# EAGLE design rpi1rev2 (EAGLE 6.5.0)
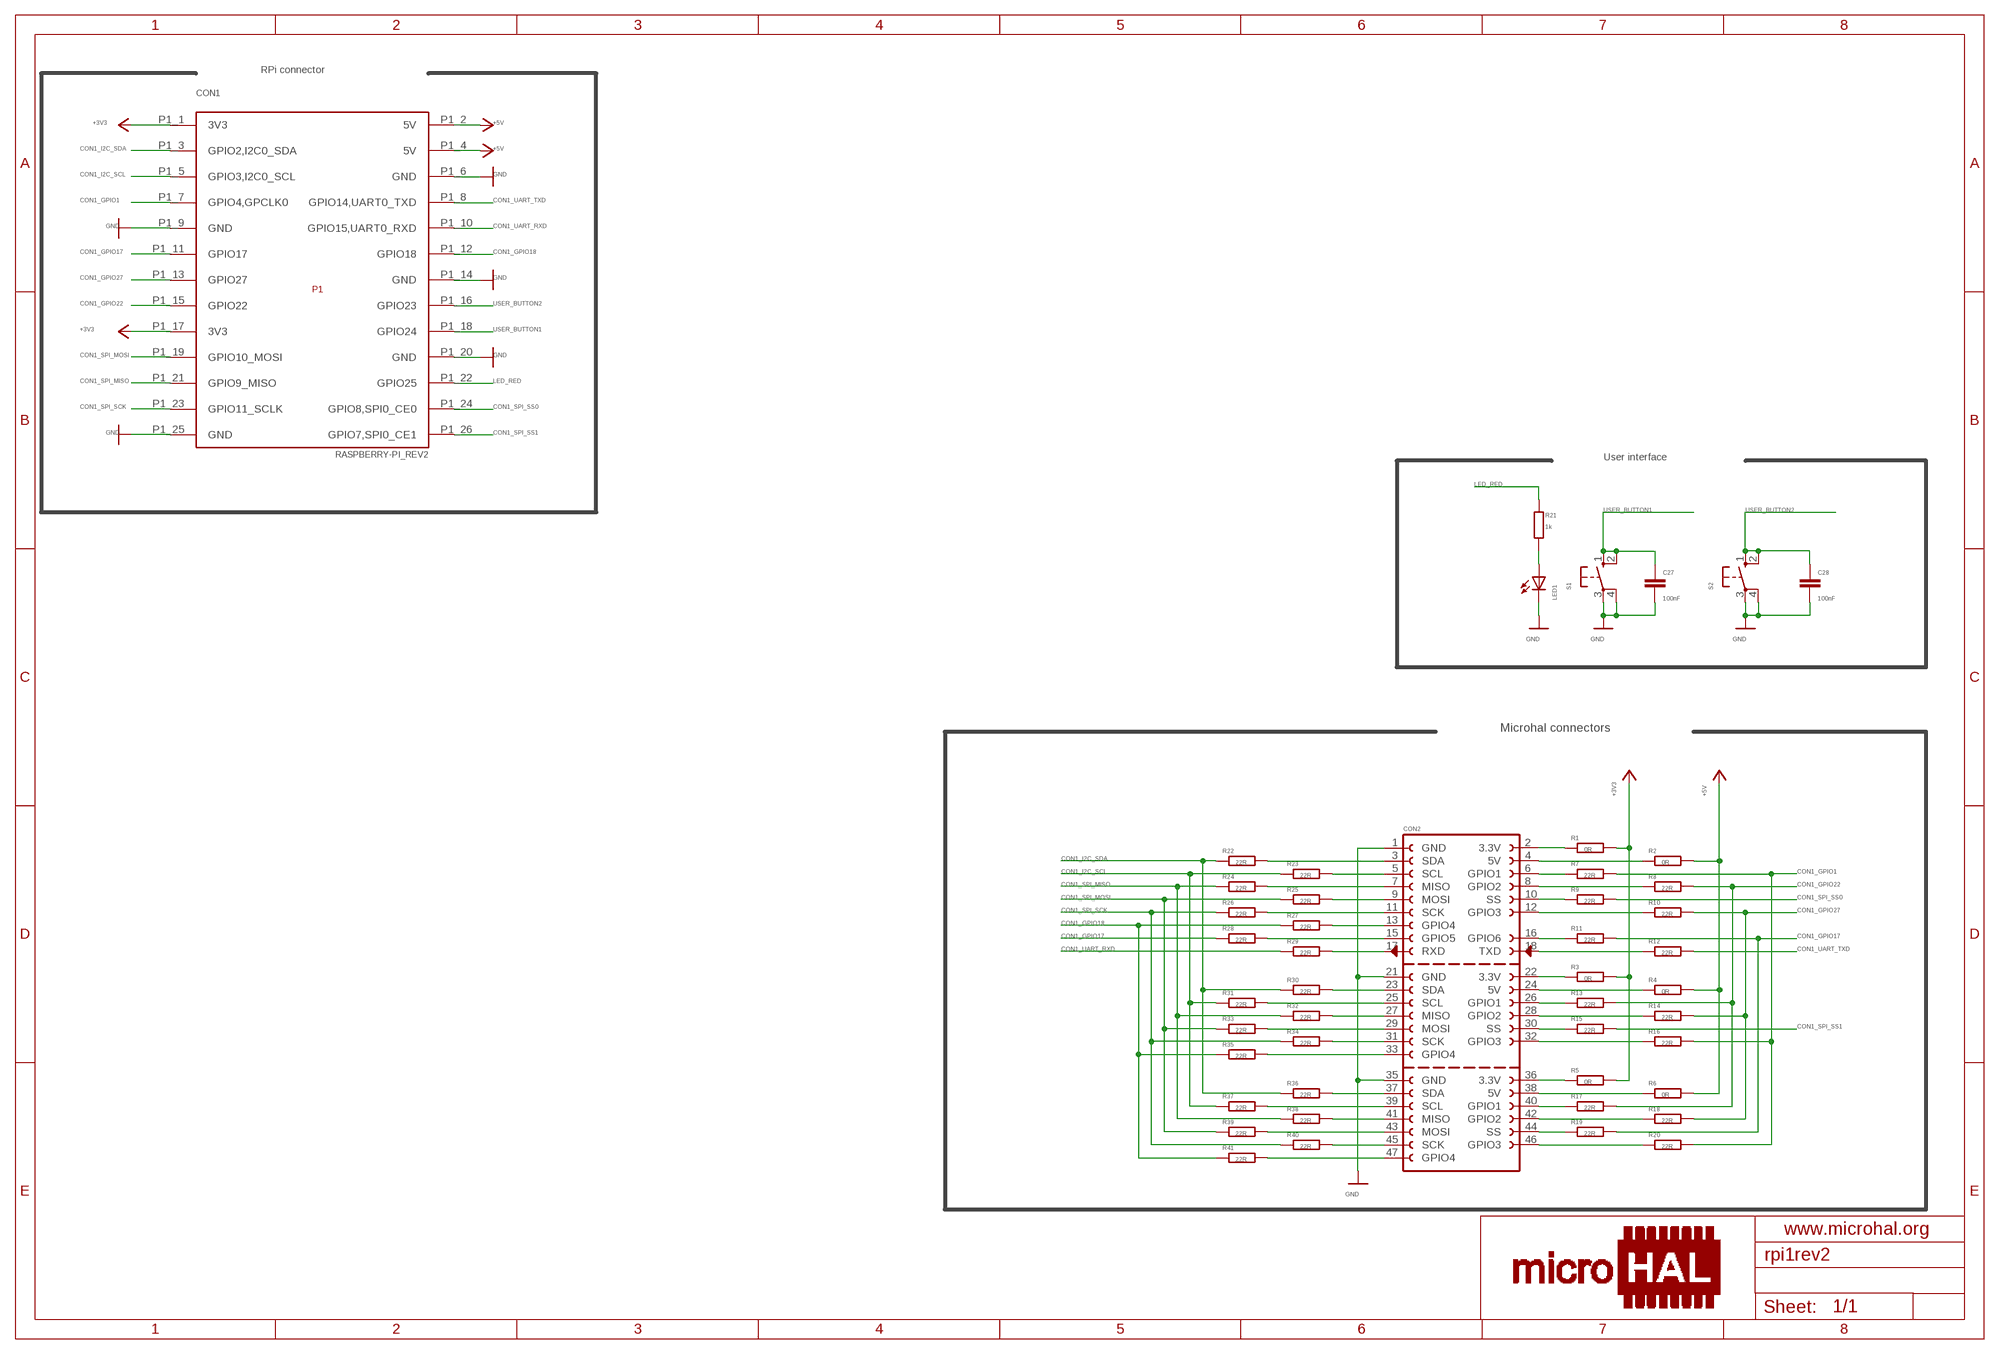
[diagram p0: schematic, sheet 1]

## Parts
C27  100nF  C-EUC0603K  [C0603K]
C28  100nF  C-EUC0603K  [C0603K]
CON1  RASPBERRY-PI_REV2  [RASPBERRY-PI_REV2]
CON2  MICROHAL_CONNECTOR_F_3  [MICROHAL_CONNECTOR_F_3]
LED1  LEDCHIPLED_0603  [CHIPLED_0603]
R1  0R  R-EU_R0603  [R0603]
R2  0R  R-EU_R0603  [R0603]
R3  0R  R-EU_R0603  [R0603]
R4  0R  R-EU_R0603  [R0603]
R5  0R  R-EU_R0603  [R0603]
R6  0R  R-EU_R0603  [R0603]
R7  22R  R-EU_R0603  [R0603]
R8  22R  R-EU_R0603  [R0603]
R9  22R  R-EU_R0603  [R0603]
R10  22R  R-EU_R0603  [R0603]
R11  22R  R-EU_R0603  [R0603]
R12  22R  R-EU_R0603  [R0603]
R13  22R  R-EU_R0603  [R0603]
R14  22R  R-EU_R0603  [R0603]
R15  22R  R-EU_R0603  [R0603]
R16  22R  R-EU_R0603  [R0603]
R17  22R  R-EU_R0603  [R0603]
R18  22R  R-EU_R0603  [R0603]
R19  22R  R-EU_R0603  [R0603]
R20  22R  R-EU_R0603  [R0603]
R21  1k  R-EU_R0603  [R0603]
R22  22R  R-EU_R0603  [R0603]
R23  22R  R-EU_R0603  [R0603]
R24  22R  R-EU_R0603  [R0603]
R25  22R  R-EU_R0603  [R0603]
R26  22R  R-EU_R0603  [R0603]
R27  22R  R-EU_R0603  [R0603]
R28  22R  R-EU_R0603  [R0603]
R29  22R  R-EU_R0603  [R0603]
R30  22R  R-EU_R0603  [R0603]
R31  22R  R-EU_R0603  [R0603]
R32  22R  R-EU_R0603  [R0603]
R33  22R  R-EU_R0603  [R0603]
R34  22R  R-EU_R0603  [R0603]
R35  22R  R-EU_R0603  [R0603]
R36  22R  R-EU_R0603  [R0603]
R37  22R  R-EU_R0603  [R0603]
R38  22R  R-EU_R0603  [R0603]
R39  22R  R-EU_R0603  [R0603]
R40  22R  R-EU_R0603  [R0603]
R41  22R  R-EU_R0603  [R0603]
S1  10-XX  [B3F-10XX]
S2  10-XX  [B3F-10XX]

## Nets
+3V3: CON1.P1_1(3V3) CON1.P1_17(3V3) R1.2 R3.2 R5.2
+5V: CON1.P1_2(5V) CON1.P1_4(5V) R2.2 R4.2 R6.2
CON1_GPIO1: CON1.P1_7(GPIO4,GPCLK0) R7.2 R16.2 R20.2
CON1_GPIO17: CON1.P1_11(GPIO17) R11.2 R19.2 R28.1
CON1_GPIO18: CON1.P1_12(GPIO18) R27.1 R35.1 R41.1
CON1_GPIO22: CON1.P1_15(GPIO22) R8.2 R13.2 R17.2
CON1_GPIO27: CON1.P1_13(GPIO27) R10.2 R14.2 R18.2
CON1_I2C_SCL: CON1.P1_5(GPIO3,I2C0_SCL) R23.1 R31.1 R37.1
CON1_I2C_SDA: CON1.P1_3(GPIO2,I2C0_SDA) R22.1 R30.1 R36.1
CON1_SPI_MISO: CON1.P1_21(GPIO9_MISO) R24.1 R32.1 R38.1
CON1_SPI_MOSI: CON1.P1_19(GPIO10_MOSI) R25.1 R33.1 R39.1
CON1_SPI_SCK: CON1.P1_23(GPIO11_SCLK) R26.1 R34.1 R40.1
CON1_SPI_SS0: CON1.P1_24(GPIO8,SPI0_CE0) R9.2
CON1_SPI_SS1: CON1.P1_26(GPIO7,SPI0_CE1) R15.2
CON1_UART_RXD: CON1.P1_10(GPIO15,UART0_RXD) R29.1
CON1_UART_TXD: CON1.P1_8(GPIO14,UART0_TXD) R12.2
GND: C27.2 C28.2 CON1.P1_6(GND) CON1.P1_9(GND) CON1.P1_14(GND) CON1.P1_20(GND) CON1.P1_25(GND) CON2.1(GND) CON2.21(GND) CON2.35(GND) LED1.C S1.3(P) S1.4(P1) S2.3(P) S2.4(P1)
LED_RED: CON1.P1_22(GPIO25) R21.2
N$1: CON2.7(MISO) R24.2
N$4: CON2.2(3.3V) R1.1
N$5: CON2.4(5V) R2.1
N$6: CON2.22(3.3V) R3.1
N$7: CON2.24(5V) R4.1
N$8: CON2.36(3.3V) R5.1
N$9: CON2.38(5V) R6.1
N$10: CON2.6(GPIO1) R7.1
N$12: CON2.8(GPIO2) R8.1
N$21: CON2.10(SS) R9.1
N$22: CON2.12(GPIO3) R10.1
N$23: CON2.16(GPIO6) R11.1
N$25: CON2.18(TXD) R12.1
N$26: CON2.26(GPIO1) R13.1
N$28: CON2.28(GPIO2) R14.1
N$29: CON2.30(SS) R15.1
N$30: CON2.32(GPIO3) R16.1
N$34: CON2.40(GPIO1) R17.1
N$35: CON2.44(SS) R19.1
N$36: CON2.42(GPIO2) R18.1
N$37: CON2.46(GPIO3) R20.1
N$51: CON2.47(GPIO4) R41.2
N$52: CON2.45(SCK) R40.2
N$53: CON2.43(MOSI) R39.2
N$54: CON2.41(MISO) R38.2
N$55: CON2.39(SCL) R37.2
N$56: CON2.37(SDA) R36.2
N$57: CON2.33(GPIO4) R35.2
N$58: CON2.31(SCK) R34.2
N$59: CON2.29(MOSI) R33.2
N$60: CON2.27(MISO) R32.2
N$61: CON2.25(SCL) R31.2
N$62: CON2.23(SDA) R30.2
N$63: CON2.17(RXD) R29.2
N$64: CON2.13(GPIO4) R27.2
N$65: CON2.9(MOSI) R25.2
N$66: CON2.5(SCL) R23.2
N$67: CON2.3(SDA) R22.2
N$68: CON2.11(SCK) R26.2
N$69: CON2.15(GPIO5) R28.2
N$103: LED1.A R21.1
USER_BUTTON1: C27.1 CON1.P1_18(GPIO24) S1.1(S) S1.2(S1)
USER_BUTTON2: C28.1 CON1.P1_16(GPIO23) S2.1(S) S2.2(S1)

## Notes on the sheet
- RPi connector
- User interface
- Microhal connectors

## Library data of the parts
C27 C28 = rcl:C-EU: CAPACITOR, European symbol
CON1 = RaspberryPi:RASPBERRY-PI_REV2: Raspberry Pi Board <http://www.raspberrypi.org/> Jacques Lagnel V1.0 (beta) 2012 Mateusz Bawaj V1.1 (beta) 2012 Board dimension: Forum 3D model <http://www.raspberrypi.org/forum/general-discussion/mechanical-profile-3d-models?value=3d%20model&type=1&include=1&search=1&ret=all> The GPIO Connector (P1): http://elinux.org/RPi_Low-level_peripherals The GPIO Connector (P5): http://www.raspberrypi-spy.co.uk/2012/09/raspberry-pi-p5-header/
CON2 = microhal-connector_v0.1:MICROHAL_CONNECTOR_F_3: Connector used in microhal development board.
LED1 = led:LED: LED OSRAM: - CHIPLED LG R971, LG N971, LY N971, LG Q971, LY Q971, LO R971, LY R971 LH N974, LH R974 LS Q976, LO Q976, LY Q976 LO Q996 - Hyper CHIPLED LW Q18S LB Q993, LB Q99A, LB R99A - SideLED LS A670, LO A670, LY A670, LG A670, LP A670 LB A673, LV A673, LT A673, LW A673 LH A674 LY A675 LS A676, LA A676, LO A676, LY A676, LW A676 LS A679, LY A679, LG A679 - Hyper Micro SIDELED® LS Y876, LA Y876, LO Y876, LY Y876 LT Y87S - SmartLED LW L88C, LW L88S LB L89C, LB L89S, LG L890 LS L89K, LO L89K, LY L89K LS L896, LA L896, LO L896, LY L896 - TOPLED LS T670, LO T670, LY T670, LG T670, LP T670 LSG T670, LSP T670, LSY T670, LOP T670, LYG T670 LG T671, LOG T671, LSG T671 LB T673, LV T673, LT T673, LW T673 LH T674 LS T676, LA T676, LO T676, LY T676, LB T676, LH T676, LSB T676, LW T676 LB T67C, LV T67C, LT T67C, LS T67K, LO T67K, LY T67K, LW E67C LS E67B, LA E67B, LO E67B, LY E67B, LB E67C, LV E67C, LT E67C LW T67C LS T679, LY T679, LG T679 LS T770, LO T770, LY T770, LG T770, LP T770 LB T773, LV T773, LT T773, LW T773 LH T774 LS E675, LA E675, LY E675, LS T675 LS T776, LA T776, LO T776, LY T776, LB T776 LHGB T686 LT T68C, LB T68C - Hyper Mini TOPLED® LB M676 - Mini TOPLED Santana® LG M470 LS M47K, LO M47K, LY M47K Source: http://www.osram.convergy.de LUXEON: - LUMILED® LXK2-PW12-R00, LXK2-PW12-S00, LXK2-PW14-U00, LXK2-PW14-V00 LXK2-PM12-R00, LXK2-PM12-S00, LXK2-PM14-U00 LXK2-PE12-Q00, LXK2-PE12-R00, LXK2-PE12-S00, LXK2-PE14-T00, LXK2-PE14-U00 LXK2-PB12-K00, LXK2-PB12-L00, LXK2-PB12-M00, LXK2-PB14-N00, LXK2-PB14-P00, LXK2-PB14-Q00 LXK2-PR12-L00, LXK2-PR12-M00, LXK2-PR14-Q00, LXK2-PR14-R00 LXK2-PD12-Q00, LXK2-PD12-R00, LXK2-PD12-S00 LXK2-PH12-R00, LXK2-PH12-S00 LXK2-PL12-P00, LXK2-PL12-Q00, LXK2-PL12-R00 Source: www.luxeon.com KINGBRIGHT: KA-3528ASYC Source: www.kingbright.com
R1-R41 = rcl:R-EU_: RESISTOR, European symbol
S1 S2 = switch-omron:10-XX: OMRON SWITCH; MPN: B3F-1000; OC_FARNELL: 176432; OC_NEWARK: 36M3542

## Board
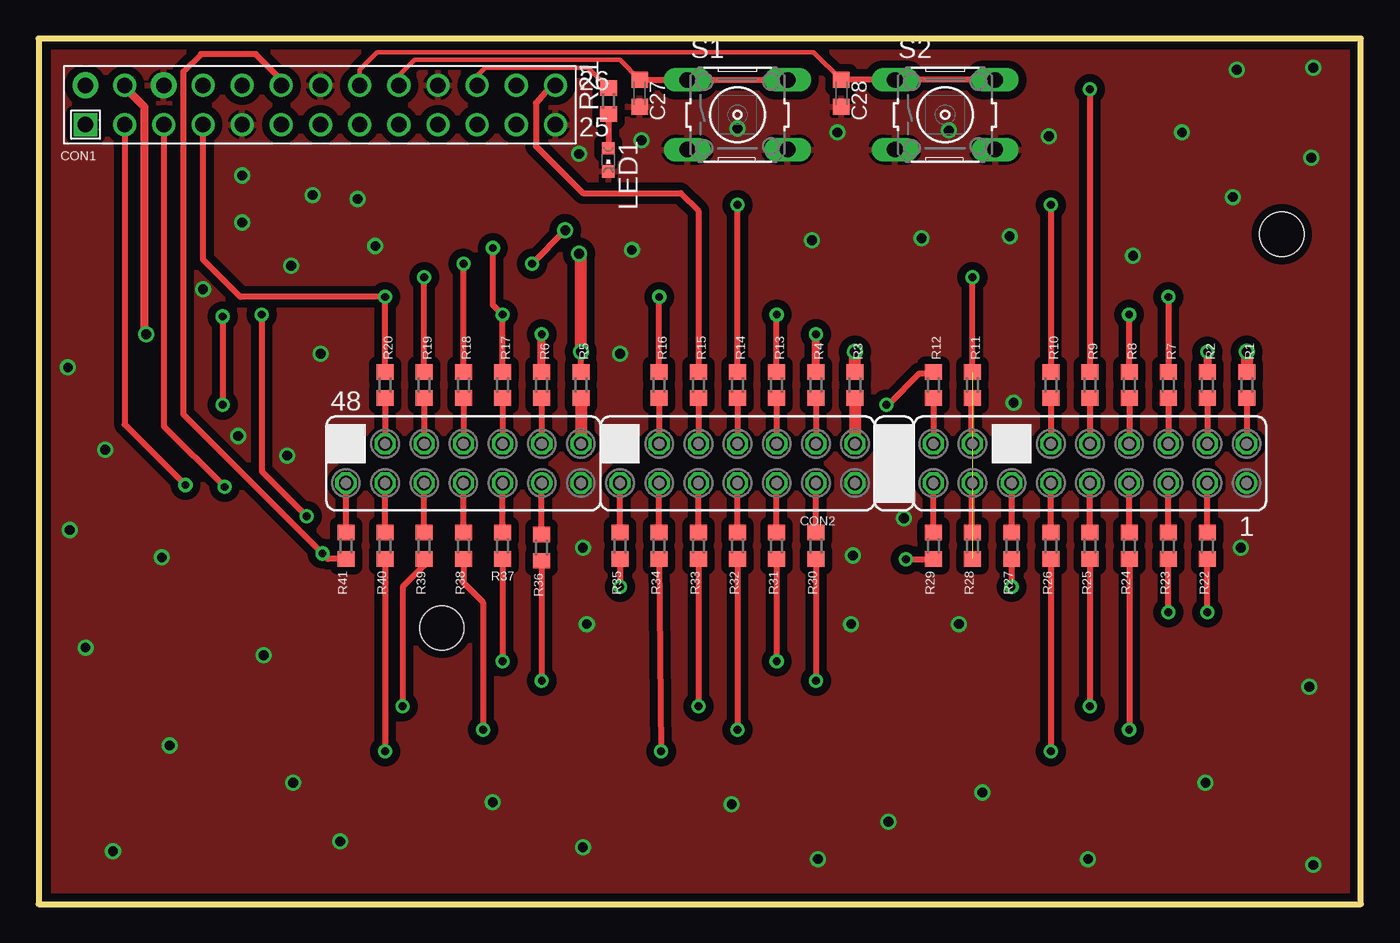
[diagram p1: board, top side]
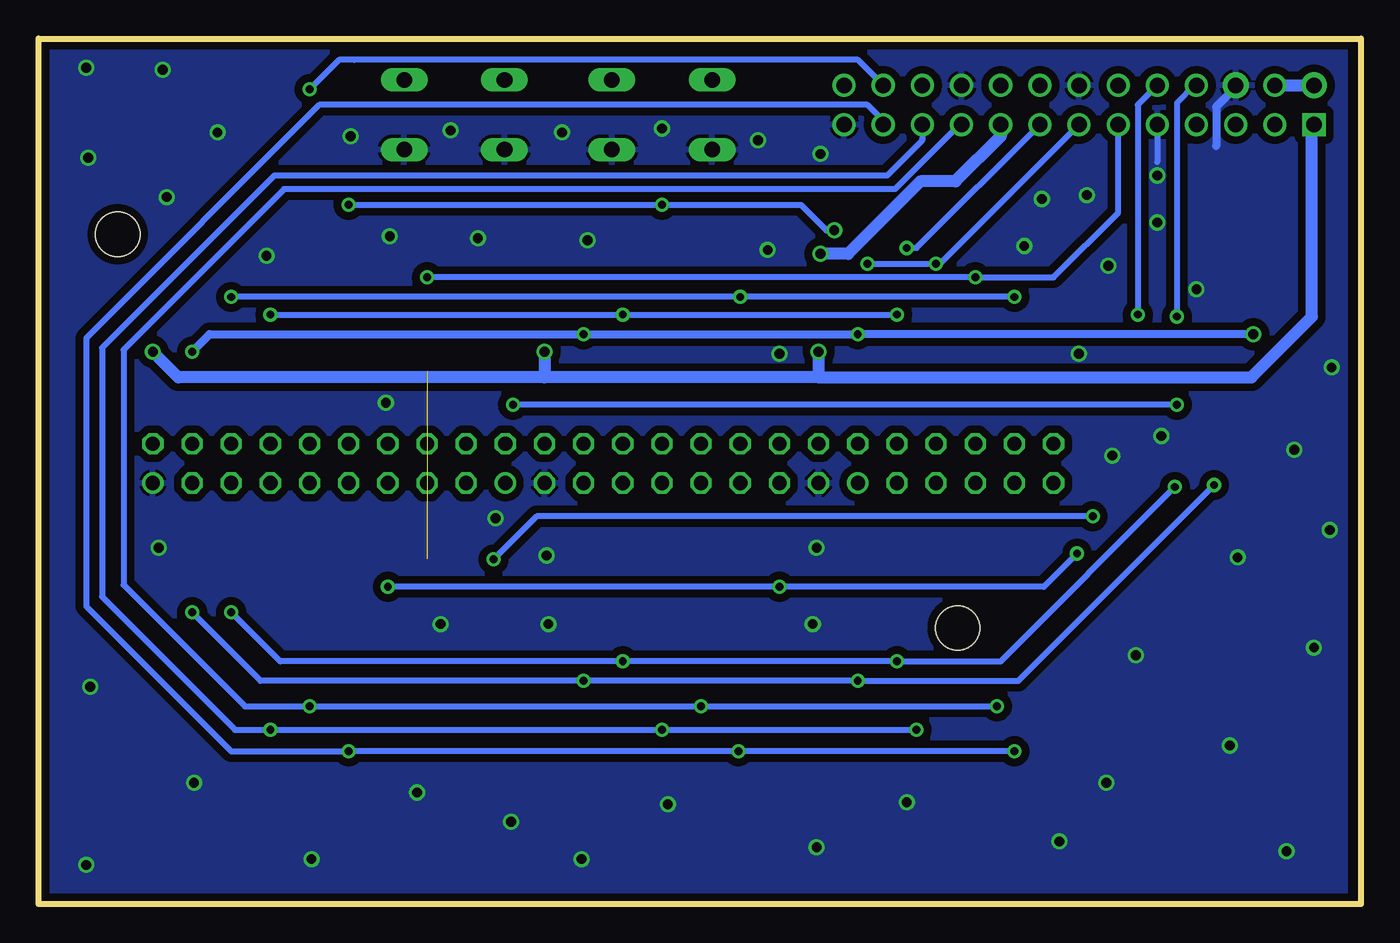
[diagram p2: board, bottom side, seen from below]

Size 85.78 x 56.12 mm. Coordinates in mm from the lower left corner, seen from the top.
Outline: 0,0 85.78,0 85.78,56.12 0,56.12 0,0
Copper layers (1*2+16): Top 0.035mm / dielectric 1.5mm / Route2 0.035mm / dielectric 0.15mm / Bottom 0.035mm
Design rules "satland_standard": minimum track width 8mil, minimum drill 0.3mm, track to track 8mil, track to pad 8mil, pad to pad 8mil, via to via 8mil, smd to smd 0mil, copper to edge 20mil, drill to drill 10mil, minimum pad ring 8mil, minimum via ring 8mil, stop-mask expansion 4mil, vias tented up to drill 0mil, thermal gap 8mil
Holes 2.87 mm at 26.16,17.91 80.64,43.43

### Footprints (pad centres in the part's own frame; a part is rotated, then mirrored left to right if it is on the bottom)
C0603K = smd 1.05 x 1.08: 1 -0.875,0; 2 0.875,0
RASPBERRY-PI_REV2 = drill 1 square: P1_1 -17.78,-1.27 | drill 1 pad 1.676: P1_2 -17.78,1.27; P1_6 -12.7,1.27 | drill 1: P1_3 -15.24,-1.27; P1_4 -15.24,1.27; P1_5 -12.7,-1.27; P1_7 -10.16,-1.27; P1_8 -10.16,1.27; P1_9 -7.62,-1.27; P1_10 -7.62,1.27; P1_11 -5.08,-1.27; P1_12 -5.08,1.27; P1_13 -2.54,-1.27; P1_14 -2.54,1.27; P1_15 0,-1.27; P1_16 0,1.27; P1_17 2.54,-1.27; P1_18 2.54,1.27; P1_19 5.08,-1.27; P1_20 5.08,1.27; P1_21 7.62,-1.27; P1_22 7.62,1.27; P1_23 10.16,-1.27; P1_24 10.16,1.27; P1_25 12.7,-1.27; P1_26 12.7,1.27
MICROHAL_CONNECTOR_F_3 = drill 0.914: 1 -33.02,1.27; 19 -10.16,1.27; 37 12.7,1.27 | drill 0.914 octagon: 2 -33.02,-1.27; 3 -30.48,1.27; 4 -30.48,-1.27; 5 -27.94,1.27; 6 -27.94,-1.27; 7 -25.4,1.27; 8 -25.4,-1.27; 9 -22.86,1.27; 10 -22.86,-1.27; 11 -20.32,1.27; 12 -20.32,-1.27; 13 -17.78,1.27; 14 -17.78,-1.27; 15 -15.24,1.27; 16 -15.24,-1.27; 17 -12.7,1.27; 18 -12.7,-1.27; 20 -10.16,-1.27; 21 -7.62,1.27; 22 -7.62,-1.27; 23 -5.08,1.27; 24 -5.08,-1.27; 25 -2.54,1.27; 26 -2.54,-1.27; 27 0,1.27; 28 0,-1.27; 29 2.54,1.27; 30 2.54,-1.27; 31 5.08,1.27; 32 5.08,-1.27; 33 7.62,1.27; 34 7.62,-1.27; 35 10.16,1.27; 36 10.16,-1.27; 38 12.7,-1.27; 39 15.24,1.27; 40 15.24,-1.27; 41 17.78,1.27; 42 17.78,-1.27; 43 20.32,1.27; 44 20.32,-1.27; 45 22.86,1.27; 46 22.86,-1.27; 47 25.4,1.27; 48 25.4,-1.27
CHIPLED_0603 = smd 0.8 x 0.8: A 0,-0.75; C 0,0.75
R0603 = smd 1 x 1.1: 1 -0.85,0; 2 0.85,0
B3F-10XX = drill 1.016 long: 1 -3.251,2.261; 2 3.251,2.261; 3 -3.251,-2.261; 4 3.251,-2.261

### Placement (x,y rotation side)
C27  38.99,52.58 270 top
C28  52.07,52.58 270 top
CON1  20.83,51.82 0 top
CON2  45.34,28.58 180 top
LED1  36.96,48.26 180 top
R1  78.36,33.66 90 top
R2  75.82,33.66 90 top
R3  52.96,33.66 90 top
R4  50.42,33.66 90 top
R5  35.18,33.66 90 top
R6  32.64,33.66 90 top
R7  73.28,33.66 90 top
R8  70.74,33.66 90 top
R9  68.2,33.66 90 top
R10  65.66,33.66 90 top
R11  60.58,33.66 90 top
R12  58.04,33.66 90 top
R13  47.88,33.66 90 top
R14  45.34,33.66 90 top
R15  42.8,33.66 90 top
R16  40.26,33.66 90 top
R17  30.1,33.66 90 top
R18  27.56,33.66 90 top
R19  25.02,33.66 90 top
R20  22.48,33.66 90 top
R21  36.96,52.07 90 top
R22  75.82,23.24 90 top
R23  73.28,23.24 90 top
R24  70.74,23.24 90 top
R25  68.2,23.24 90 top
R26  65.66,23.24 90 top
R27  63.12,23.24 90 top
R28  60.58,23.24 90 top
R29  58.04,23.24 90 top
R30  50.42,23.24 90 top
R31  47.88,23.24 90 top
R32  45.34,23.24 90 top
R33  42.8,23.24 90 top
R34  40.26,23.24 90 top
R35  37.72,23.24 90 top
R36  32.64,23.11 90 top
R37  30.1,23.24 90 top
R38  27.56,23.24 90 top
R39  25.02,23.24 90 top
R40  22.48,23.24 90 top
R41  19.94,23.24 90 top
S1  45.34,51.18 0 top
S2  58.8,51.18 0 top

### Tracks (layer width: path | path; a pad name or v marks a point on that pad's centre or on a via)
+3V3  (via drill 0.64)
  Top 0.381: R5.2 v35.18,35.81
  Top 0.762: v78.36,35.81 R1.2 | R3.2 v52.96,35.81 | v35.18,35.81 35.18,42.04 v35.05,42.16
  Bottom 0.762: 35.18,34.16 52.96,34.16 | v52.96,35.81 52.96,34.16 | v35.18,35.81 35.18,34.16 | 52.96,34.16 76.71,34.16 v78.36,35.81 | 35.18,34.16 7.11,34.16 3.18,38.1 3.18,50.42 CON1.P1_1 | CON1.P1_17 23.37,49.78 26.29,46.86 28.57,46.86 33.27,42.16 v35.05,42.16
+5V  (via drill 0.51, 0.64)
  Top 0.381: CON1.P1_4 5.59,52.96
  Top 0.457: 6.86,37.08 v6.99,36.96
  Top 0.508: 5.59,52.96 6.86,51.69 6.86,37.08 | v75.82,35.81 R2.2 | R4.2 v50.42,36.96 | R6.2 v32.64,36.96
  Bottom 0.508: v75.82,35.81 74.68,36.96 v50.42,36.96 v32.64,36.96 v6.99,36.96
  Bottom 0.762: CON1.P1_4 CON1.P1_2
CON1_GPIO1  (via drill 0.51)
  Top 0.381: v73.28,39.37 R7.2 | R16.2 v40.26,39.37 | R20.2 v22.48,39.37 13.08,39.37 10.67,41.78 CON1.P1_7
  Bottom 0.381: v22.48,39.37 v40.26,39.37 v73.28,39.37
CON1_GPIO17  (via drill 0.51)  (1 unrouted)
  Top 0.381: R11.2 v60.58,40.64 | R19.2 v25.02,40.64
  Bottom 0.381: v60.58,40.64 v25.02,40.64 19.94,40.64 15.75,44.83 CON1.P1_11
CON1_GPIO18  (via drill 0.51)
  Top 0.381: v63.12,20.57 R27.1 | R35.1 v37.72,20.57 | R41.1 18.76,22.39 v18.41,22.73 9.4,31.75 9.4,53.97 10.54,55.12 14.1,55.12 15.75,53.47 CON1.P1_12
  Bottom 0.381: v63.12,20.57 v37.72,20.57 20.57,20.57 v18.41,22.73
CON1_GPIO22  (via drill 0.51)
  Top 0.381: R8.2 v70.74,38.23 | R17.2 v30.1,38.23 29.46,38.86 v29.46,42.55 | R13.2 v47.88,38.23
  Bottom 0.381: v70.74,38.23 v47.88,38.23 v30.1,38.23 | v29.46,42.55 28.83,42.55 CON1.P1_15
CON1_GPIO27  (via drill 0.51, 0.64)
  Top 0.381: v65.66,45.34 R10.2 | R14.2 v45.34,45.34 | R18.2 v27.56,41.53 | v32,41.53 v34.16,43.69
  Bottom 0.381: v65.66,45.34 v45.34,45.34 36.32,45.34 34.67,43.69 v34.16,43.69 | v32,41.53 v27.56,41.53 27.31,41.53 CON1.P1_13
CON1_I2C_SCL  (via drill 0.51)
  Top 0.381: R31.1 v47.88,15.75 | v73.28,18.92 R23.1 | CON1.P1_5 8.13,30.99 v12.07,27.05 | R37.1 v30.1,15.75
  Bottom 0.381: v73.28,18.92 70.1,15.75 v47.88,15.75 v30.1,15.75 23.37,15.75 v12.07,27.05
CON1_I2C_SDA  (via drill 0.51)
  Top 0.381: v75.82,18.92 R22.1 | R30.1 v50.42,14.48 | R36.1 v32.64,14.48 | CON1.P1_3 5.59,31.12 v9.53,27.18
  Bottom 0.381: v75.82,18.92 71.37,14.48 v50.42,14.48 v32.64,14.48 22.23,14.48 v9.53,27.18
CON1_SPI_MISO  (via drill 0.51)
  Top 0.381: R24.1 v70.74,11.3 | R32.1 v45.34,11.3 | R38.1 27.56,20.83 28.83,19.56 v28.83,11.3
  Bottom 0.381: v28.83,11.3 v45.34,11.3 v70.74,11.3 73.02,11.3 81.66,19.94 81.66,36.07 70.48,47.24 30.73,47.24 28.45,49.53 28.45,49.66 CON1.P1_21
CON1_SPI_MOSI  (via drill 0.51)
  Top 0.381: R33.1 v42.8,12.83 | R25.1 v68.2,12.83 | R39.1 25.02,21.97 23.62,20.57 v23.62,12.83
  Bottom 0.381: v23.62,12.83 v42.8,12.83 v68.2,12.83 72.39,12.83 80.26,20.7 80.26,35.94 69.85,46.35 30.23,46.35 26.04,50.55 CON1.P1_19
CON1_SPI_SCK  (via drill 0.51)
  Top 0.381: R40.1 v22.48,9.91 | R26.1 v65.66,9.91 | R34.1 v40.39,9.91
  Bottom 0.381: v22.48,9.91 v40.39,9.91 v65.66,9.91 73.28,9.91 82.68,19.3 82.68,36.7 67.56,51.82 32,51.82 30.99,50.8 CON1.P1_23
CON1_SPI_SS0  (via drill 0.51)
  Top 0.381: v68.2,52.83 R9.2
  Bottom 0.381: CON1.P1_24 32.64,54.74 65.28,54.74 66.29,54.74 v68.2,52.83
CON1_SPI_SS1
  Top 0.381: CON1.P1_26 33.27,53.09 32.26,51.94 32.26,49.15 35.31,46.1 41.66,46.1 42.8,44.96 R15.2
CON1_UART_RXD  (via drill 0.51)
  Top 0.381: v14.48,38.23 14.48,28.07 v17.4,25.15 | v56.26,22.35 58,22.35 R29.1
  Bottom 0.381: CON1.P1_10 14.48,51.82 v14.48,38.23 | v17.4,25.15 53.47,25.15 v56.26,22.35
CON1_UART_TXD  (via drill 0.51)
  Top 0.381: v11.94,38.1 v11.94,32.38 | v54.99,32.38 55.12,32.38 57.15,34.42 57.95,34.42 R12.2
  Bottom 0.381: v11.94,32.38 v54.99,32.38 | CON1.P1_8 10.8,53.09 11.94,51.94 v11.94,38.1
GND  (via drill 0.64)
  Bottom 0.381: CON1.P1_9 13.21,48.13
  Bottom 0.508: CON1.P1_6 8.13,52.96 9.4,51.69 9.4,49.15
  other vias: 1.91,34.8 4.32,29.46 2.03,24.26 8,22.48 3.05,16.64 14.61,16.13 8.51,10.29 4.83,3.43 16.51,7.87 19.56,4.06 29.46,6.6 35.31,3.68 44.96,6.48 50.55,2.92 61.21,7.24 68.07,2.92 75.69,7.87 82.68,2.54 82.42,14.1 55.12,5.33 52.7,18.16 59.69,18.16 35.56,18.16 35.31,23.11 52.83,22.61 56.13,25.02 77.98,23.11 16.13,29.08 12.95,30.35 18.29,35.69 63.25,32.51 82.68,54.23 82.55,48.39 77.72,54.1 74.17,50.04 77.47,45.85 65.53,49.78 59.05,50.17 51.82,50.04 45.34,50.29 39.12,49.53 35.05,48.64 10.67,39.88 13.21,44.2 16.38,41.4 17.78,45.97 21.84,42.67 38.48,42.42 50.17,43.05 57.28,43.18 62.99,43.31 70.99,42.04 37.72,35.69 13.21,47.24 20.7,45.72
  pour Top (isolate 0.508): 1.02,56.13 85.6,56.13 85.6,-0.13 1.02,-0.13
  pour Bottom (isolate 0.508): 1.02,56.13 85.6,56.13 85.6,-0.13 1.02,-0.13
LED_RED
  Top 0.305: CON1.P1_22 28.45,53.72 28.96,54.23 35.65,54.23 R21.2
N$1
  Top 0.381: R24.2 CON2.7
N$4
  Top 0.381: R1.1 CON2.2
N$5
  Top 0.381: R2.1 CON2.4
N$6
  Top 0.762: R3.1 CON2.22
N$7
  Top 0.381: R4.1 CON2.24
N$8
  Top 0.762: R5.1 CON2.36
N$9
  Top 0.381: R6.1 CON2.38
N$10
  Top 0.381: R7.1 CON2.6
N$12
  Top 0.381: R8.1 CON2.8
N$21
  Top 0.381: R9.1 CON2.10
N$22
  Top 0.381: R10.1 CON2.12
N$23
  Top 0.381: CON2.16 60.58,30.66 60.5,30.73 60.5,32.71 60.58,32.79 R11.1
N$25
  Top 0.381: R12.1 CON2.18
N$26
  Top 0.381: R13.1 CON2.26
N$28
  Top 0.381: R14.1 CON2.28
N$29
  Top 0.381: R15.1 CON2.30
N$30
  Top 0.381: R16.1 CON2.32
N$34
  Top 0.381: R17.1 CON2.40
N$35
  Top 0.381: R19.1 CON2.44
N$36
  Top 0.381: R18.1 CON2.42
N$37
  Top 0.381: R20.1 CON2.46
N$51
  Top 0.381: R41.2 CON2.47
N$52
  Top 0.381: R40.2 CON2.45
N$53
  Top 0.381: R39.2 CON2.43
N$54
  Top 0.381: R38.2 CON2.41
N$55
  Top 0.381: R37.2 CON2.39
N$56
  Top 0.381: R36.2 CON2.37
N$57
  Top 0.381: R35.2 CON2.33
N$58
  Top 0.381: R34.2 CON2.31
N$59
  Top 0.381: R33.2 CON2.29
N$60
  Top 0.381: R32.2 CON2.27
N$61
  Top 0.381: R31.2 CON2.25
N$62
  Top 0.381: R30.2 CON2.23
N$63
  Top 0.381: R29.2 CON2.17
N$64
  Top 0.381: R27.2 CON2.13
N$65
  Top 0.381: R25.2 CON2.9
N$66
  Top 0.381: R23.2 CON2.5
N$67
  Top 0.381: R22.2 CON2.3
N$68
  Top 0.381: R26.2 CON2.11
N$69
  Top 0.381: CON2.15 60.58,26.49 60.5,26.42 60.5,24.18 R28.2
N$103
  Top 0.381: R21.1 LED1.A
USER_BUTTON1
  Top 0.305: CON1.P1_18 23.37,53.72 24.38,54.74 37.7,54.74 C27.1
  Top 0.381: C27.1 S1.1 S1.2
USER_BUTTON2
  Top 0.305: CON1.P1_16 20.83,54.1 21.97,55.25 50.28,55.25 C28.1
  Top 0.381: C28.1 52.08,53.44 S2.1 S2.2